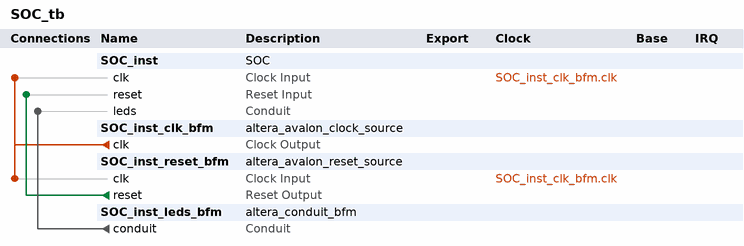
[diagram p0: system contents]
# Platform Designer (Qsys) system SOC_tb, Cyclone V 5CGXFC7C7F23C8
# Parameters at their usual value, and those the tool derives, are not listed.
package require -exact qsys 18.0
create_system SOC_tb
set_project_property DEVICE_FAMILY {Cyclone V}
set_project_property DEVICE 5CGXFC7C7F23C8

add_instance SOC_inst SOC 1.0

add_instance SOC_inst_clk_bfm altera_avalon_clock_source 18.0

add_instance SOC_inst_reset_bfm altera_avalon_reset_source 18.0
set_instance_parameter_value SOC_inst_reset_bfm ASSERT_HIGH_RESET 0
set_instance_parameter_value SOC_inst_reset_bfm INITIAL_RESET_CYCLES 50

add_instance SOC_inst_leds_bfm altera_conduit_bfm 18.0
set_instance_parameter_value SOC_inst_leds_bfm CLOCKED_SIGNAL false
set_instance_parameter_value SOC_inst_leds_bfm ENABLE_RESET false
set_instance_parameter_value SOC_inst_leds_bfm SIGNAL_DIRECTIONS input
set_instance_parameter_value SOC_inst_leds_bfm SIGNAL_WIDTHS 32

# connections
add_connection SOC_inst_clk_bfm.clk SOC_inst.clk clock
add_connection SOC_inst_clk_bfm.clk SOC_inst_reset_bfm.clk clock
add_connection SOC_inst_reset_bfm.reset SOC_inst.reset reset
add_connection SOC_inst_leds_bfm.conduit SOC_inst.leds conduit

set_interconnect_requirement {$system} qsys_mm.clockCrossingAdapter HANDSHAKE
set_interconnect_requirement {$system} qsys_mm.enableEccProtection FALSE
set_interconnect_requirement {$system} qsys_mm.insertDefaultSlave FALSE
set_interconnect_requirement {$system} qsys_mm.maxAdditionalLatency 1

save_system SOC_tb.qsys
